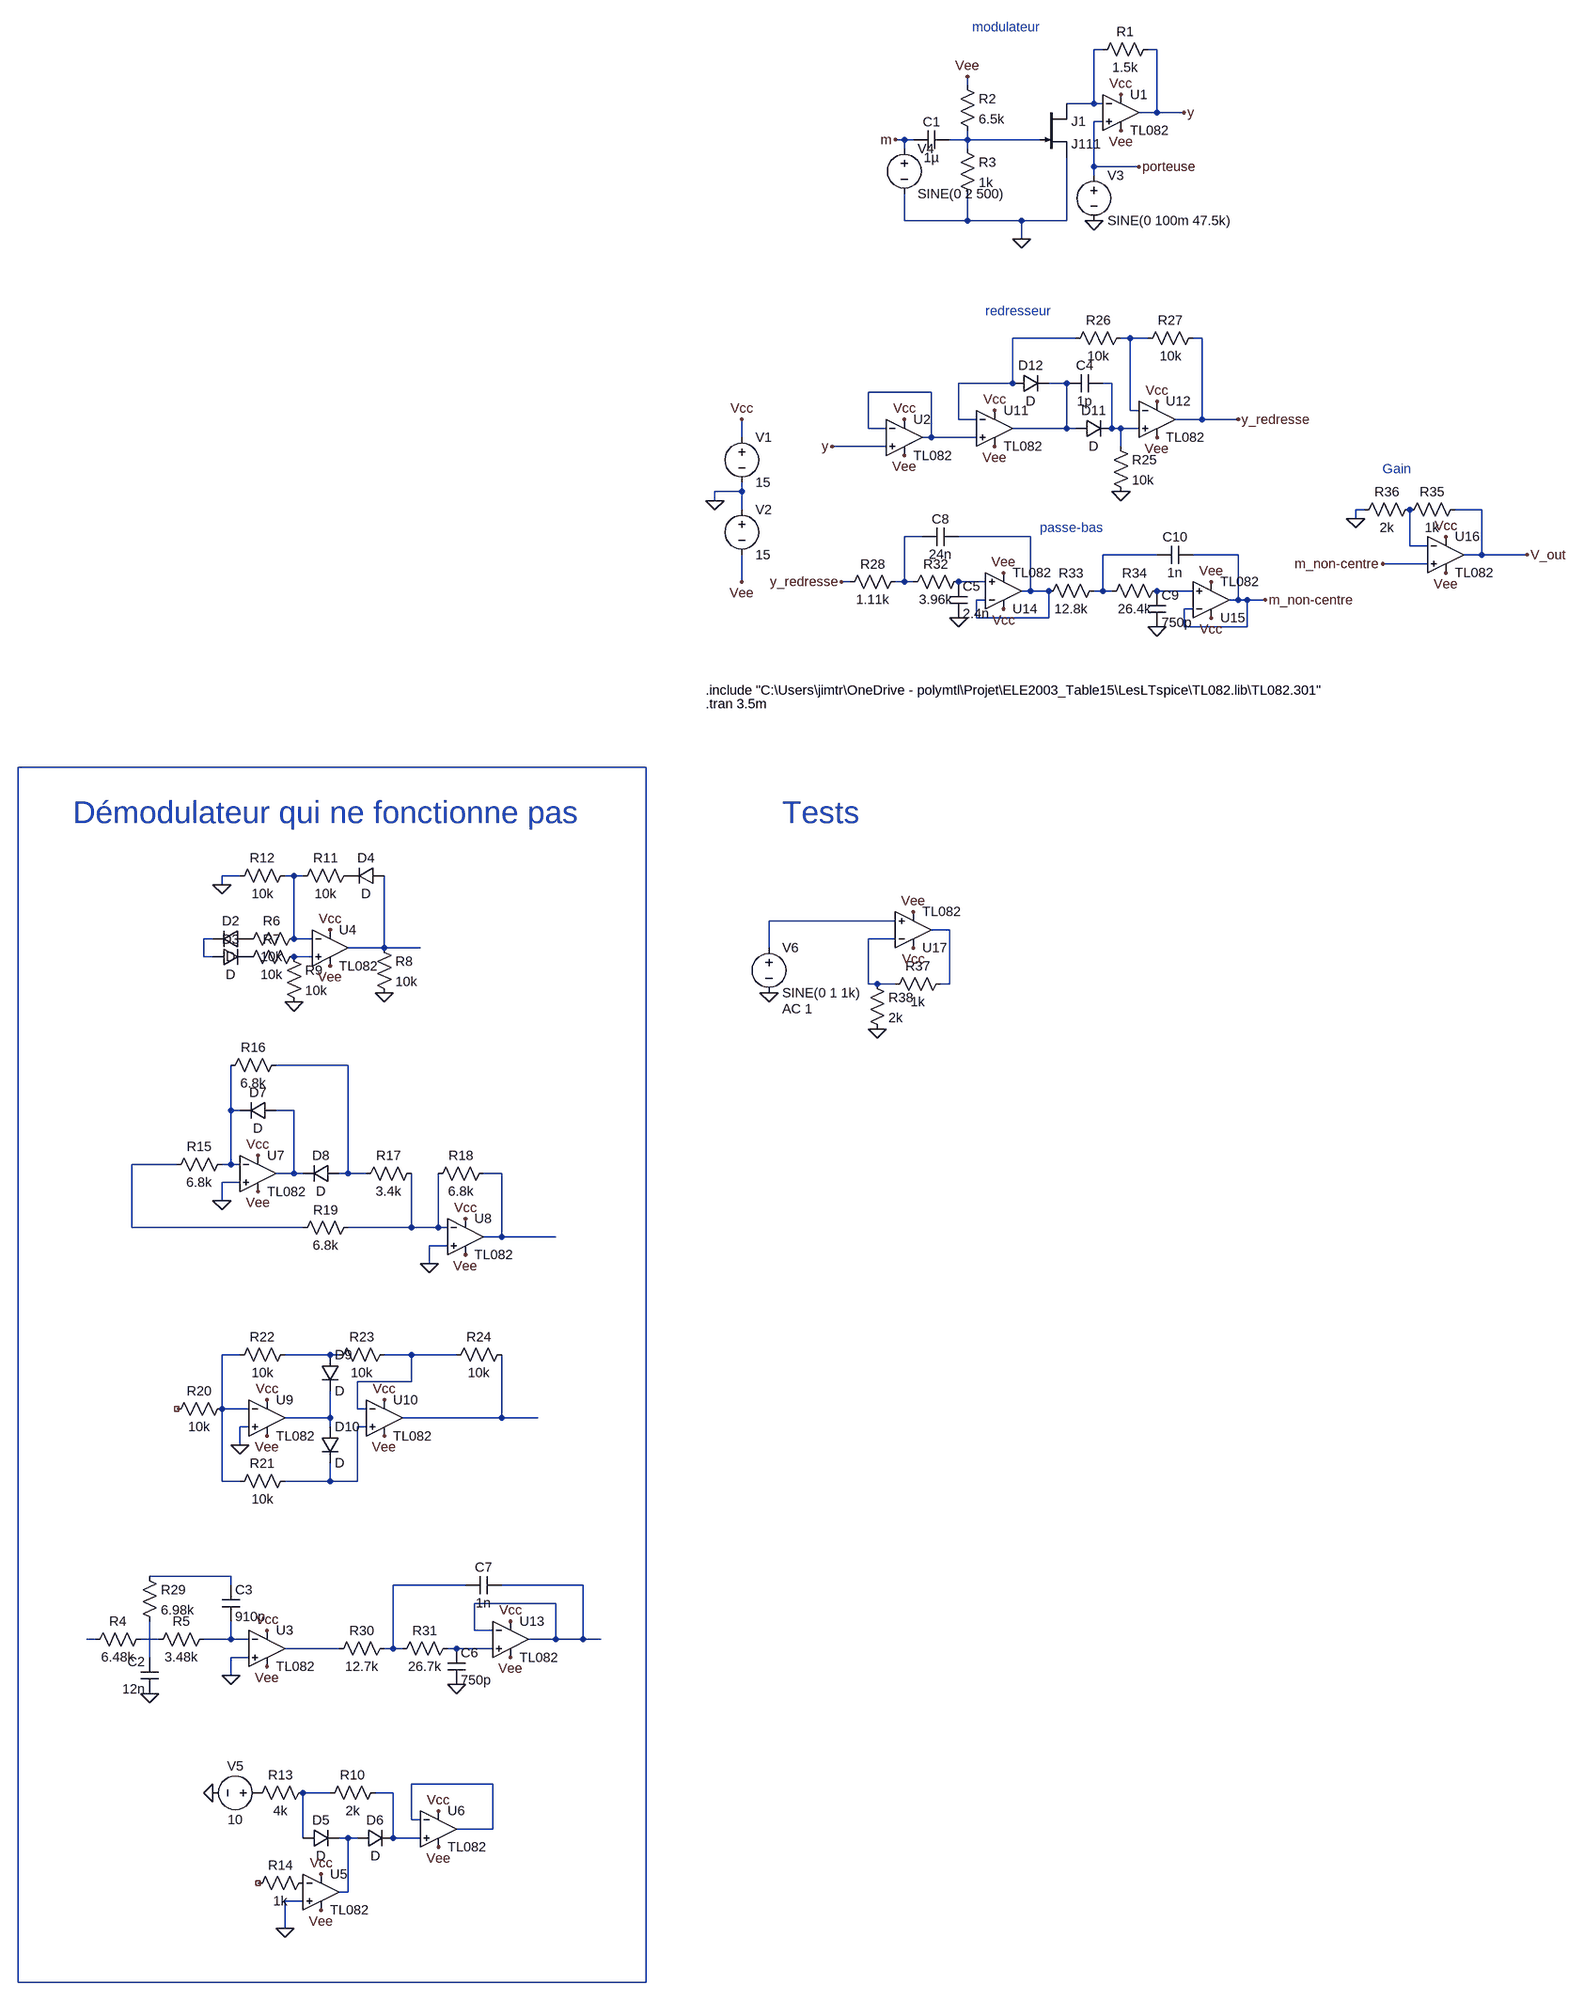
[diagram p0: schematic MonDemodulateur.asc]
MonDemodulateur.asc, the LTspice schematic file:
Version 4.1
SHEET 1 2820 3396
WIRE 752 -320 736 -320
WIRE 848 -320 832 -320
WIRE 512 -256 512 -272
WIRE 736 -224 736 -320
WIRE 736 -224 688 -224
WIRE 752 -224 736 -224
WIRE 848 -208 848 -320
WIRE 848 -208 816 -208
WIRE 896 -208 848 -208
WIRE 752 -192 736 -192
WIRE 400 -160 384 -160
WIRE 416 -160 400 -160
WIRE 512 -160 512 -176
WIRE 512 -160 480 -160
WIRE 640 -160 512 -160
WIRE 400 -144 400 -160
WIRE 512 -144 512 -160
WIRE 736 -112 736 -192
WIRE 816 -112 736 -112
WIRE 736 -96 736 -112
WIRE 400 -16 400 -64
WIRE 512 -16 512 -64
WIRE 512 -16 400 -16
WIRE 608 -16 512 -16
WIRE 688 -16 688 -128
WIRE 688 -16 608 -16
WIRE 608 16 608 -16
WIRE 704 192 592 192
WIRE 800 192 784 192
WIRE 832 192 800 192
WIRE 928 192 912 192
WIRE 592 272 592 192
WIRE 592 272 496 272
WIRE 688 272 656 272
WIRE 768 272 752 272
WIRE 448 288 336 288
WIRE 800 320 800 192
WIRE 816 320 800 320
WIRE 496 336 496 272
WIRE 528 336 496 336
WIRE 928 336 928 192
WIRE 928 336 880 336
WIRE 992 336 928 336
WIRE 336 352 336 288
WIRE 368 352 336 352
WIRE 688 352 688 272
WIRE 688 352 592 352
WIRE 704 352 688 352
WIRE 768 352 768 272
WIRE 784 352 768 352
WIRE 816 352 784 352
WIRE 112 368 112 336
WIRE 448 368 448 288
WIRE 448 368 432 368
WIRE 528 368 448 368
WIRE 368 384 272 384
WIRE 784 384 784 352
WIRE 112 464 112 448
WIRE 112 464 64 464
WIRE 64 480 64 464
WIRE 112 496 112 464
WIRE 1216 496 1200 496
WIRE 1424 496 1376 496
WIRE 1200 512 1200 496
WIRE 432 544 400 544
WIRE 624 544 496 544
WIRE 1296 560 1296 496
WIRE 1328 560 1296 560
WIRE 848 576 752 576
WIRE 992 576 912 576
WIRE 1424 576 1424 496
WIRE 1424 576 1392 576
WIRE 1504 576 1424 576
WIRE 1328 592 1248 592
WIRE 112 624 112 576
WIRE 304 624 288 624
WIRE 400 624 400 544
WIRE 400 624 384 624
WIRE 416 624 400 624
WIRE 544 624 496 624
WIRE 624 640 624 544
WIRE 624 640 608 640
WIRE 656 640 624 640
WIRE 752 640 752 576
WIRE 752 640 736 640
WIRE 768 640 752 640
WIRE 912 640 848 640
WIRE 544 656 528 656
WIRE 992 656 992 576
WIRE 992 656 976 656
WIRE 1008 656 992 656
WIRE 1040 656 1008 656
WIRE 912 672 896 672
WIRE 528 688 528 656
WIRE 656 688 656 640
WIRE 656 688 528 688
WIRE 896 704 896 672
WIRE 1008 704 1008 656
WIRE 1008 704 896 704
WIRE -288 1168 -1408 1168
WIRE -1008 1360 -1040 1360
WIRE -912 1360 -928 1360
WIRE -896 1360 -912 1360
WIRE -1040 1376 -1040 1360
WIRE 384 1440 160 1440
WIRE 480 1456 448 1456
WIRE -1056 1472 -1072 1472
WIRE -912 1472 -912 1360
WIRE -880 1472 -912 1472
WIRE 384 1472 336 1472
WIRE -752 1488 -752 1360
WIRE -752 1488 -816 1488
WIRE -688 1488 -752 1488
WIRE 160 1488 160 1440
WIRE -1072 1504 -1072 1472
WIRE -1056 1504 -1072 1504
WIRE -880 1504 -912 1504
WIRE 336 1552 336 1472
WIRE 352 1552 336 1552
WIRE 384 1552 352 1552
WIRE 480 1552 480 1456
WIRE 480 1552 464 1552
WIRE -816 1696 -944 1696
WIRE -1024 1776 -1024 1696
WIRE -1008 1776 -1024 1776
WIRE -912 1776 -944 1776
WIRE -1120 1872 -1200 1872
WIRE -1024 1872 -1024 1776
WIRE -1024 1872 -1040 1872
WIRE -1008 1872 -1024 1872
WIRE -912 1888 -912 1776
WIRE -912 1888 -944 1888
WIRE -896 1888 -912 1888
WIRE -816 1888 -816 1696
WIRE -816 1888 -832 1888
WIRE -784 1888 -816 1888
WIRE -544 1888 -576 1888
WIRE -1008 1904 -1040 1904
WIRE -1040 1936 -1040 1904
WIRE -1200 1984 -1200 1872
WIRE -896 1984 -1200 1984
WIRE -704 1984 -704 1888
WIRE -704 1984 -816 1984
WIRE -656 1984 -656 1888
WIRE -656 1984 -704 1984
WIRE -640 1984 -656 1984
WIRE -544 2000 -544 1888
WIRE -544 2000 -576 2000
WIRE -448 2000 -544 2000
WIRE -640 2016 -672 2016
WIRE -672 2048 -672 2016
WIRE -1008 2256 -1040 2256
WIRE -848 2256 -928 2256
WIRE -832 2256 -848 2256
WIRE -704 2256 -752 2256
WIRE -624 2256 -704 2256
WIRE -704 2304 -704 2256
WIRE -704 2304 -800 2304
WIRE -1040 2352 -1040 2256
WIRE -992 2352 -1040 2352
WIRE -800 2352 -800 2304
WIRE -784 2352 -800 2352
WIRE -848 2368 -848 2320
WIRE -848 2368 -928 2368
WIRE -544 2368 -544 2256
WIRE -544 2368 -720 2368
WIRE -480 2368 -544 2368
WIRE -992 2384 -1008 2384
WIRE -848 2384 -848 2368
WIRE -784 2384 -800 2384
WIRE -1008 2416 -1008 2384
WIRE -1040 2480 -1040 2352
WIRE -1008 2480 -1040 2480
WIRE -848 2480 -848 2448
WIRE -848 2480 -928 2480
WIRE -800 2480 -800 2384
WIRE -800 2480 -848 2480
WIRE -1024 2672 -1168 2672
WIRE -1024 2688 -1024 2672
WIRE -608 2688 -736 2688
WIRE -400 2688 -544 2688
WIRE -448 2720 -592 2720
WIRE -592 2768 -592 2720
WIRE -560 2768 -592 2768
WIRE -1264 2784 -1280 2784
WIRE -1152 2784 -1184 2784
WIRE -1024 2784 -1024 2752
WIRE -1024 2784 -1072 2784
WIRE -992 2784 -1024 2784
WIRE -448 2784 -448 2720
WIRE -448 2784 -496 2784
WIRE -400 2784 -400 2688
WIRE -400 2784 -448 2784
WIRE -368 2784 -400 2784
WIRE -832 2800 -928 2800
WIRE -736 2800 -736 2688
WIRE -736 2800 -752 2800
WIRE -720 2800 -736 2800
WIRE -624 2800 -640 2800
WIRE -560 2800 -624 2800
WIRE -1168 2816 -1168 2752
WIRE -992 2816 -1024 2816
WIRE -1024 2848 -1024 2816
WIRE -560 3040 -704 3040
WIRE -848 3056 -896 3056
WIRE -736 3056 -768 3056
WIRE -704 3104 -704 3040
WIRE -688 3104 -704 3104
WIRE -560 3120 -560 3040
WIRE -560 3120 -624 3120
WIRE -896 3136 -896 3056
WIRE -816 3136 -832 3136
WIRE -800 3136 -816 3136
WIRE -736 3136 -736 3056
WIRE -688 3136 -736 3136
WIRE -816 3232 -816 3136
WIRE -816 3232 -832 3232
WIRE -896 3248 -928 3248
WIRE -928 3296 -928 3248
WIRE -1408 3392 -1408 1168
WIRE -288 3392 -288 1168
WIRE -288 3392 -1408 3392
FLAG 64 480 0
FLAG 112 624 Vee
FLAG 112 336 Vcc
FLAG 784 -176 Vee
FLAG 784 -240 Vcc
FLAG 896 -208 y
FLAG 736 -16 0
FLAG 816 -112 porteuse
FLAG 608 16 0
FLAG 512 -272 Vee
FLAG 384 -160 m
FLAG 400 400 Vee
FLAG 400 336 Vcc
FLAG 272 384 y
FLAG -848 1520 Vee
FLAG -848 1456 Vcc
FLAG -752 1568 0
FLAG -1040 1376 0
FLAG -912 1584 0
FLAG -864 3200 Vcc
FLAG -864 3264 Vee
FLAG -928 3296 0
FLAG -1056 3056 0
FLAG -656 3088 Vcc
FLAG -656 3152 Vee
FLAG -976 1920 Vee
FLAG -976 1856 Vcc
FLAG -1040 1936 0
FLAG -672 2048 0
FLAG -608 2032 Vee
FLAG -608 1968 Vcc
FLAG -960 2336 Vcc
FLAG -752 2336 Vcc
FLAG -960 2400 Vee
FLAG -752 2400 Vee
FLAG -1008 2416 0
FLAG 560 384 Vee
FLAG 560 320 Vcc
FLAG 848 368 Vee
FLAG 848 304 Vcc
FLAG 784 464 0
FLAG 992 336 y_redresse
FLAG -960 2832 Vee
FLAG -960 2768 Vcc
FLAG -1024 2848 0
FLAG -1168 2880 0
FLAG -624 2864 0
FLAG -528 2816 Vee
FLAG -528 2752 Vcc
FLAG 496 688 0
FLAG 576 608 Vee
FLAG 576 672 Vcc
FLAG 848 704 0
FLAG 944 624 Vee
FLAG 944 688 Vcc
FLAG 288 624 y_redresse
FLAG 1040 656 m_non-centre
FLAG 1248 592 m_non-centre
FLAG 1360 544 Vcc
FLAG 1360 608 Vee
FLAG 1200 512 0
FLAG 1504 576 V_out
FLAG 416 1488 Vcc
FLAG 416 1424 Vee
FLAG 160 1568 0
FLAG 352 1632 0
SYMBOL voltage 112 352 R0
WINDOW 123 0 0 Left 0
WINDOW 39 0 0 Left 0
SYMATTR InstName V1
SYMATTR Value 15
SYMBOL voltage 112 480 R0
WINDOW 123 0 0 Left 0
WINDOW 39 0 0 Left 0
SYMATTR InstName V2
SYMATTR Value 15
SYMBOL OpAmps\\opamp2 784 -272 R0
SYMATTR InstName U1
SYMATTR Value TL082
SYMBOL res 848 -336 R90
WINDOW 0 0 56 VBottom 2
WINDOW 3 32 56 VTop 2
SYMATTR InstName R1
SYMATTR Value 1.5k
SYMBOL res 496 -272 R0
SYMATTR InstName R2
SYMATTR Value 6.5k
SYMBOL res 496 -160 R0
SYMATTR InstName R3
SYMATTR Value 1k
SYMBOL njf 640 -224 R0
SYMATTR InstName J1
SYMATTR Value J111
SYMBOL voltage 736 -112 R0
WINDOW 123 0 0 Left 0
WINDOW 39 0 0 Left 0
SYMATTR InstName V3
SYMATTR Value SINE(0 100m 47.5k)
SYMBOL cap 480 -176 R90
WINDOW 0 0 32 VBottom 2
WINDOW 3 32 32 VTop 2
SYMATTR InstName C1
SYMATTR Value 1µ
SYMBOL voltage 400 -160 R0
WINDOW 123 0 0 Left 0
WINDOW 39 0 0 Left 0
SYMATTR InstName V4
SYMATTR Value SINE(0 2 500)
SYMBOL OpAmps\\opamp2 400 304 R0
SYMATTR InstName U2
SYMATTR Value TL082
SYMBOL OpAmps\\opamp2 -848 1424 R0
SYMATTR InstName U4
SYMATTR Value TL082
SYMBOL diode -992 1456 R90
WINDOW 0 0 32 VBottom 2
WINDOW 3 32 32 VTop 2
SYMATTR InstName D2
SYMBOL diode -1056 1520 R270
WINDOW 0 32 32 VTop 2
WINDOW 3 0 32 VBottom 2
SYMATTR InstName D3
SYMBOL res -768 1472 R0
SYMATTR InstName R8
SYMATTR Value 10k
SYMBOL res -928 1488 R0
SYMATTR InstName R9
SYMATTR Value 10k
SYMBOL res -912 1344 R90
WINDOW 0 0 56 VBottom 2
WINDOW 3 32 56 VTop 2
SYMATTR InstName R12
SYMATTR Value 10k
SYMBOL res -800 1344 R90
WINDOW 0 0 56 VBottom 2
WINDOW 3 32 56 VTop 2
SYMATTR InstName R11
SYMATTR Value 10k
SYMBOL diode -752 1344 R90
WINDOW 0 0 32 VBottom 2
WINDOW 3 32 32 VTop 2
SYMATTR InstName D4
SYMBOL res -896 1456 R90
WINDOW 0 0 56 VBottom 2
WINDOW 3 32 56 VTop 2
SYMATTR InstName R6
SYMATTR Value 10k
SYMBOL res -896 1488 R90
WINDOW 0 0 56 VBottom 2
WINDOW 3 32 56 VTop 2
SYMATTR InstName R7
SYMATTR Value 10k
SYMBOL OpAmps\\opamp2 -864 3168 R0
SYMATTR InstName U5
SYMATTR Value TL082
SYMBOL diode -896 3152 R270
WINDOW 0 32 32 VTop 2
WINDOW 3 0 32 VBottom 2
SYMATTR InstName D5
SYMBOL diode -800 3152 R270
WINDOW 0 32 32 VTop 2
WINDOW 3 0 32 VBottom 2
SYMATTR InstName D6
SYMBOL res -752 3040 R90
WINDOW 0 0 56 VBottom 2
WINDOW 3 32 56 VTop 2
SYMATTR InstName R10
SYMATTR Value 2k
SYMBOL res -880 3040 R90
WINDOW 0 0 56 VBottom 2
WINDOW 3 32 56 VTop 2
SYMATTR InstName R13
SYMATTR Value 4k
SYMBOL res -880 3200 R90
WINDOW 0 0 56 VBottom 2
WINDOW 3 32 56 VTop 2
SYMATTR InstName R14
SYMATTR Value 1k
SYMBOL voltage -960 3056 R90
WINDOW 0 -32 56 VBottom 2
WINDOW 3 32 56 VTop 2
WINDOW 123 0 0 Left 0
WINDOW 39 0 0 Left 0
SYMATTR InstName V5
SYMATTR Value 10
SYMBOL OpAmps\\opamp2 -656 3056 R0
SYMATTR InstName U6
SYMATTR Value TL082
SYMBOL res -1024 1856 R90
WINDOW 0 0 56 VBottom 2
WINDOW 3 32 56 VTop 2
SYMATTR InstName R15
SYMATTR Value 6.8k
SYMBOL OpAmps\\opamp2 -976 1824 R0
SYMATTR InstName U7
SYMATTR Value TL082
SYMBOL diode -944 1760 R90
WINDOW 0 0 32 VBottom 2
WINDOW 3 32 32 VTop 2
SYMATTR InstName D7
SYMBOL res -928 1680 R90
WINDOW 0 0 56 VBottom 2
WINDOW 3 32 56 VTop 2
SYMATTR InstName R16
SYMATTR Value 6.8k
SYMBOL diode -832 1872 R90
WINDOW 0 0 32 VBottom 2
WINDOW 3 32 32 VTop 2
SYMATTR InstName D8
SYMBOL res -688 1872 R90
WINDOW 0 0 56 VBottom 2
WINDOW 3 32 56 VTop 2
SYMATTR InstName R17
SYMATTR Value 3.4k
SYMBOL OpAmps\\opamp2 -608 1936 R0
SYMATTR InstName U8
SYMATTR Value TL082
SYMBOL res -560 1872 R90
WINDOW 0 0 56 VBottom 2
WINDOW 3 32 56 VTop 2
SYMATTR InstName R18
SYMATTR Value 6.8k
SYMBOL res -800 1968 R90
WINDOW 0 0 56 VBottom 2
WINDOW 3 32 56 VTop 2
SYMATTR InstName R19
SYMATTR Value 6.8k
SYMBOL OpAmps\\opamp2 -960 2304 R0
SYMATTR InstName U9
SYMATTR Value TL082
SYMBOL OpAmps\\opamp2 -752 2304 R0
SYMATTR InstName U10
SYMATTR Value TL082
SYMBOL res -1024 2336 R90
WINDOW 0 0 56 VBottom 2
WINDOW 3 32 56 VTop 2
SYMATTR InstName R20
SYMATTR Value 10k
SYMBOL res -912 2464 R90
WINDOW 0 0 56 VBottom 2
WINDOW 3 32 56 VTop 2
SYMATTR InstName R21
SYMATTR Value 10k
SYMBOL res -912 2240 R90
WINDOW 0 0 56 VBottom 2
WINDOW 3 32 56 VTop 2
SYMATTR InstName R22
SYMATTR Value 10k
SYMBOL res -736 2240 R90
WINDOW 0 0 56 VBottom 2
WINDOW 3 32 56 VTop 2
SYMATTR InstName R23
SYMATTR Value 10k
SYMBOL res -528 2240 R90
WINDOW 0 0 56 VBottom 2
WINDOW 3 32 56 VTop 2
SYMATTR InstName R24
SYMATTR Value 10k
SYMBOL diode -864 2256 R0
SYMATTR InstName D9
SYMBOL diode -864 2384 R0
SYMATTR InstName D10
SYMBOL OpAmps\\opamp2 560 288 R0
SYMATTR InstName U11
SYMATTR Value TL082
SYMBOL diode 704 368 R270
WINDOW 0 32 32 VTop 2
WINDOW 3 0 32 VBottom 2
SYMATTR InstName D11
SYMBOL cap 752 256 R90
WINDOW 0 0 32 VBottom 2
WINDOW 3 32 32 VTop 2
SYMATTR InstName C4
SYMATTR Value 1p
SYMBOL diode 592 288 R270
WINDOW 0 32 32 VTop 2
WINDOW 3 0 32 VBottom 2
SYMATTR InstName D12
SYMBOL OpAmps\\opamp2 848 272 R0
SYMATTR InstName U12
SYMATTR Value TL082
SYMBOL res 768 368 R0
SYMATTR InstName R25
SYMATTR Value 10k
SYMBOL res 800 176 R90
WINDOW 0 0 56 VBottom 2
WINDOW 3 32 56 VTop 2
SYMATTR InstName R26
SYMATTR Value 10k
SYMBOL res 928 176 R90
WINDOW 0 0 56 VBottom 2
WINDOW 3 32 56 VTop 2
SYMATTR InstName R27
SYMATTR Value 10k
SYMBOL res -1168 2768 R90
WINDOW 0 0 56 VBottom 2
WINDOW 3 32 56 VTop 2
SYMATTR InstName R4
SYMATTR Value 6.48k
SYMBOL res -1056 2768 R90
WINDOW 0 0 56 VBottom 2
WINDOW 3 32 56 VTop 2
SYMATTR InstName R5
SYMATTR Value 3.48k
SYMBOL cap -1152 2880 R180
WINDOW 0 24 56 Left 2
WINDOW 3 24 8 Left 2
SYMATTR InstName C2
SYMATTR Value 12n
SYMBOL res -1184 2656 R0
SYMATTR InstName R29
SYMATTR Value 6.98k
SYMBOL cap -1040 2688 R0
SYMATTR InstName C3
SYMATTR Value 910p
SYMBOL OpAmps\\opamp2 -960 2736 R0
SYMATTR InstName U3
SYMATTR Value TL082
SYMBOL res -736 2784 R90
WINDOW 0 0 56 VBottom 2
WINDOW 3 32 56 VTop 2
SYMATTR InstName R30
SYMATTR Value 12.7k
SYMBOL res -624 2784 R90
WINDOW 0 0 56 VBottom 2
WINDOW 3 32 56 VTop 2
SYMATTR InstName R31
SYMATTR Value 26.7k
SYMBOL cap -640 2800 R0
SYMATTR InstName C6
SYMATTR Value 750p
SYMBOL OpAmps\\opamp2 -528 2720 R0
SYMATTR InstName U13
SYMATTR Value TL082
SYMBOL cap -544 2672 R90
WINDOW 0 0 32 VBottom 2
WINDOW 3 32 32 VTop 2
SYMATTR InstName C7
SYMATTR Value 1n
SYMBOL res 400 608 R90
WINDOW 0 0 56 VBottom 2
WINDOW 3 32 56 VTop 2
SYMATTR InstName R28
SYMATTR Value 1.11k
SYMBOL res 512 608 R90
WINDOW 0 0 56 VBottom 2
WINDOW 3 32 56 VTop 2
SYMATTR InstName R32
SYMATTR Value 3.96k
SYMBOL cap 480 624 R0
SYMATTR InstName C5
SYMATTR Value 2.4n
SYMBOL cap 496 528 R90
WINDOW 0 0 32 VBottom 2
WINDOW 3 32 32 VTop 2
SYMATTR InstName C8
SYMATTR Value 24n
SYMBOL OpAmps\\opamp2 576 704 M180
SYMATTR InstName U14
SYMATTR Value TL082
SYMBOL res 752 624 R90
WINDOW 0 0 56 VBottom 2
WINDOW 3 32 56 VTop 2
SYMATTR InstName R33
SYMATTR Value 12.8k
SYMBOL res 864 624 R90
WINDOW 0 0 56 VBottom 2
WINDOW 3 32 56 VTop 2
SYMATTR InstName R34
SYMATTR Value 26.4k
SYMBOL cap 832 640 R0
SYMATTR InstName C9
SYMATTR Value 750p
SYMBOL OpAmps\\opamp2 944 720 M180
SYMATTR InstName U15
SYMATTR Value TL082
SYMBOL cap 912 560 R90
WINDOW 0 0 32 VBottom 2
WINDOW 3 32 32 VTop 2
SYMATTR InstName C10
SYMATTR Value 1n
SYMBOL OpAmps\\opamp2 1360 512 R0
SYMATTR InstName U16
SYMATTR Value TL082
SYMBOL res 1392 480 R90
WINDOW 0 0 56 VBottom 2
WINDOW 3 32 56 VTop 2
SYMATTR InstName R35
SYMATTR Value 1k
SYMBOL res 1312 480 R90
WINDOW 0 0 56 VBottom 2
WINDOW 3 32 56 VTop 2
SYMATTR InstName R36
SYMATTR Value 2k
SYMBOL voltage 160 1472 R0
WINDOW 123 24 124 Left 2
WINDOW 39 0 0 Left 0
SYMATTR Value2 AC 1
SYMATTR InstName V6
SYMATTR Value SINE(0 1 1k)
SYMBOL OpAmps\\opamp2 416 1520 M180
SYMATTR InstName U17
SYMATTR Value TL082
SYMBOL res 480 1536 R90
WINDOW 0 0 56 VBottom 2
WINDOW 3 32 56 VTop 2
SYMATTR InstName R37
SYMATTR Value 1k
SYMBOL res 336 1536 R0
SYMATTR InstName R38
SYMATTR Value 2k
TEXT 48 816 Left 2 !.include "C:\\Users\\jimtr\\OneDrive - polymtl\\Projet\\ELE2003_Table15\\LesLTspice\\TL082.lib\\TL082.301"
TEXT 48 840 Left 2 !.tran 3.5m
TEXT 520 -360 Left 2 ;modulateur
TEXT 544 144 Left 2 ;redresseur
TEXT 1248 424 Left 2 ;Gain
TEXT 640 528 Left 2 ;passe-bas
TEXT -1304 1248 Left 5 ;Démodulateur qui ne fonctionne pas
TEXT 184 1248 Left 5 ;Tests

The netlist it stands for:
* MonDemodulateur.asc
V1 Vcc 0 15
V2 0 Vee 15
X§U1 porteuse N001 Vcc Vee y TL082  ; pins In+ In- V+ V- OUT
R1 y N001 1.5k
R2 Vee N002 6.5k
R3 N002 0 1k
J1 N001 N002 0 J111
V3 porteuse 0 SINE(0 100m 47.5k)
C1 N002 m 1µ
V4 m 0 SINE(0 2 500)
X§U2 y N007 Vcc Vee N007 TL082  ; pins In+ In- V+ V- OUT
X§U4 N021 N015 Vcc Vee N020 TL082  ; pins In+ In- V+ V- OUT
D2 P001 N018 D
D3 N018 P002 D
R8 N020 0 10k
R9 N021 0 10k
R12 N015 0 10k
R11 P003 N015 10k
D4 N020 P003 D
R6 N015 P001 10k
R7 N021 P002 10k
X§U5 0 P004 Vcc Vee N046 TL082  ; pins In+ In- V+ V- OUT
D5 N044 N046 D
D6 N046 N045 D
R10 N045 N044 2k
R13 N044 P005 4k
R14 P004 NC_01 1k
V5 P005 0 10
X§U6 N045 N043 Vcc Vee N043 TL082  ; pins In+ In- V+ V- OUT
R15 N023 N025 6.8k
X§U7 0 N023 Vcc Vee N024 TL082  ; pins In+ In- V+ V- OUT
D7 N024 N023 D
R16 N022 N023 6.8k
D8 N022 N024 D
R17 N027 N022 3.4k
X§U8 0 N027 Vcc Vee N026 TL082  ; pins In+ In- V+ V- OUT
R18 N026 N027 6.8k
R19 N027 N025 6.8k
X§U9 0 N028 Vcc Vee N031 TL082  ; pins In+ In- V+ V- OUT
X§U10 N033 N030 Vcc Vee N032 TL082  ; pins In+ In- V+ V- OUT
R20 N028 NC_02 10k
R21 N033 N028 10k
R22 N029 N028 10k
R23 N030 N029 10k
R24 N032 N030 10k
D9 N029 N031 D
D10 N031 N033 D
X§U11 N007 N003 Vcc Vee N005 TL082  ; pins In+ In- V+ V- OUT
D11 N005 N006 D
C4 N006 N005 1p
D12 N003 N005 D
X§U12 N006 N004 Vcc Vee y_redresse TL082  ; pins In+ In- V+ V- OUT
R25 N006 0 10k
R26 N004 N003 10k
R27 y_redresse N004 10k
R4 N038 N037 6.48k
R5 N039 N038 3.48k
C2 0 N042 12n
R29 N034 N042 6.98k
C3 N034 N039 910p
X§U3 0 N039 Vcc Vee N040 TL082  ; pins In+ In- V+ V- OUT
R30 N035 N040 12.7k
R31 N041 N035 26.7k
C6 N041 0 750p
X§U13 N041 N036 Vcc Vee N036 TL082  ; pins In+ In- V+ V- OUT
C7 N036 N035 1n
R28 N008 y_redresse 1.11k
R32 N012 N008 3.96k
C5 N012 0 2.4n
C8 N009 N008 24n
X§U14 N012 N009 Vcc Vee N009 TL082  ; pins In+ In- V+ V- OUT
R33 N011 N009 12.8k
R34 N013 N011 26.4k
C9 N013 0 750p
X§U15 N013 m_non-centre Vcc Vee m_non-centre TL082  ; pins In+ In- V+ V- OUT
C10 m_non-centre N011 1n
X§U16 m_non-centre N010 Vcc Vee V_out TL082  ; pins In+ In- V+ V- OUT
R35 V_out N010 1k
R36 N010 0 2k
V6 N016 0 SINE(0 1 1k) AC 1
X§U17 N016 N019 Vcc Vee N017 TL082  ; pins In+ In- V+ V- OUT
R37 N017 N019 1k
R38 N019 0 2k
.model D D
.lib standard.dio
.model NJF NJF
.model PJF PJF
.lib standard.jft
.include "C:\Users\jimtr\OneDrive - polymtl\Projet\ELE2003_Table15\LesLTspice\TL082.lib\TL082.301"
.tran 3.5m
* modulateur
* redresseur
* Gain
* passe-bas
* Démodulateur qui ne fonctionne pas
* Tests
.backanno
.end